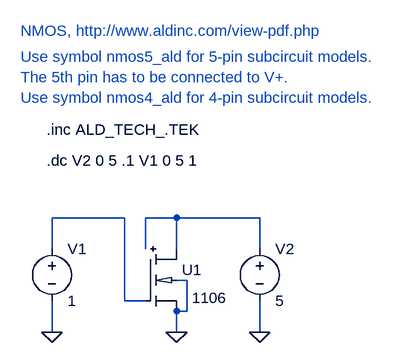
[diagram p0: schematic ALD_nmos_1106.asc]
ALD_nmos_1106.asc, the LTspice schematic file:
Version 4
SHEET 1 880 680
WIRE 96 64 -16 64
WIRE 176 64 128 64
WIRE 304 64 176 64
WIRE -16 112 -16 64
WIRE 128 112 128 64
WIRE 176 112 176 64
WIRE 304 112 304 64
WIRE 192 160 176 160
WIRE 96 192 96 64
WIRE 128 192 96 192
WIRE 192 208 192 160
WIRE 192 208 176 208
WIRE -16 240 -16 192
WIRE 176 240 176 208
WIRE 304 240 304 192
FLAG 176 240 0
FLAG -16 240 0
FLAG 304 240 0
SYMBOL voltage 304 96 R0
SYMATTR InstName V2
SYMATTR Value 5
SYMBOL voltage -16 96 R0
SYMATTR InstName V1
SYMATTR Value 1
SYMBOL nmos5_ald 128 112 R0
WINDOW 0 56 32 Left 2
WINDOW 3 72 75 Left 2
SYMATTR InstName U1
SYMATTR Value 1106
TEXT -24 -24 Left 2 !.dc V2 0 5 .1 V1 0 5 1
TEXT -24 -72 Left 2 !.inc ALD_TECH_.TEK
TEXT -64 -224 Left 2 ;NMOS, http://www.aldinc.com/view-pdf.php
TEXT -64 -184 Left 2 ;Use symbol nmos5_ald for 5-pin subcircuit models. \nThe 5th pin has to be connected to V+.\nUse symbol nmos4_ald for 4-pin subcircuit models.

The netlist it stands for:
* ALD_nmos_1106.asc
V2 N002 0 5
V1 N001 0 1
XU1 N002 N001 0 0 N002 1106  ; pins D G S B V+
.dc V2 0 5 .1 V1 0 5 1
.inc ALD_TECH_.TEK
* NMOS, http://www.aldinc.com/view-pdf.php
* Use symbol nmos5_ald for 5-pin subcircuit models.
* The 5th pin has to be connected to V+.
* Use symbol nmos4_ald for 4-pin subcircuit models.
.backanno
.end